# EAGLE design PiZero-RAK (EAGLE 9.0.1)
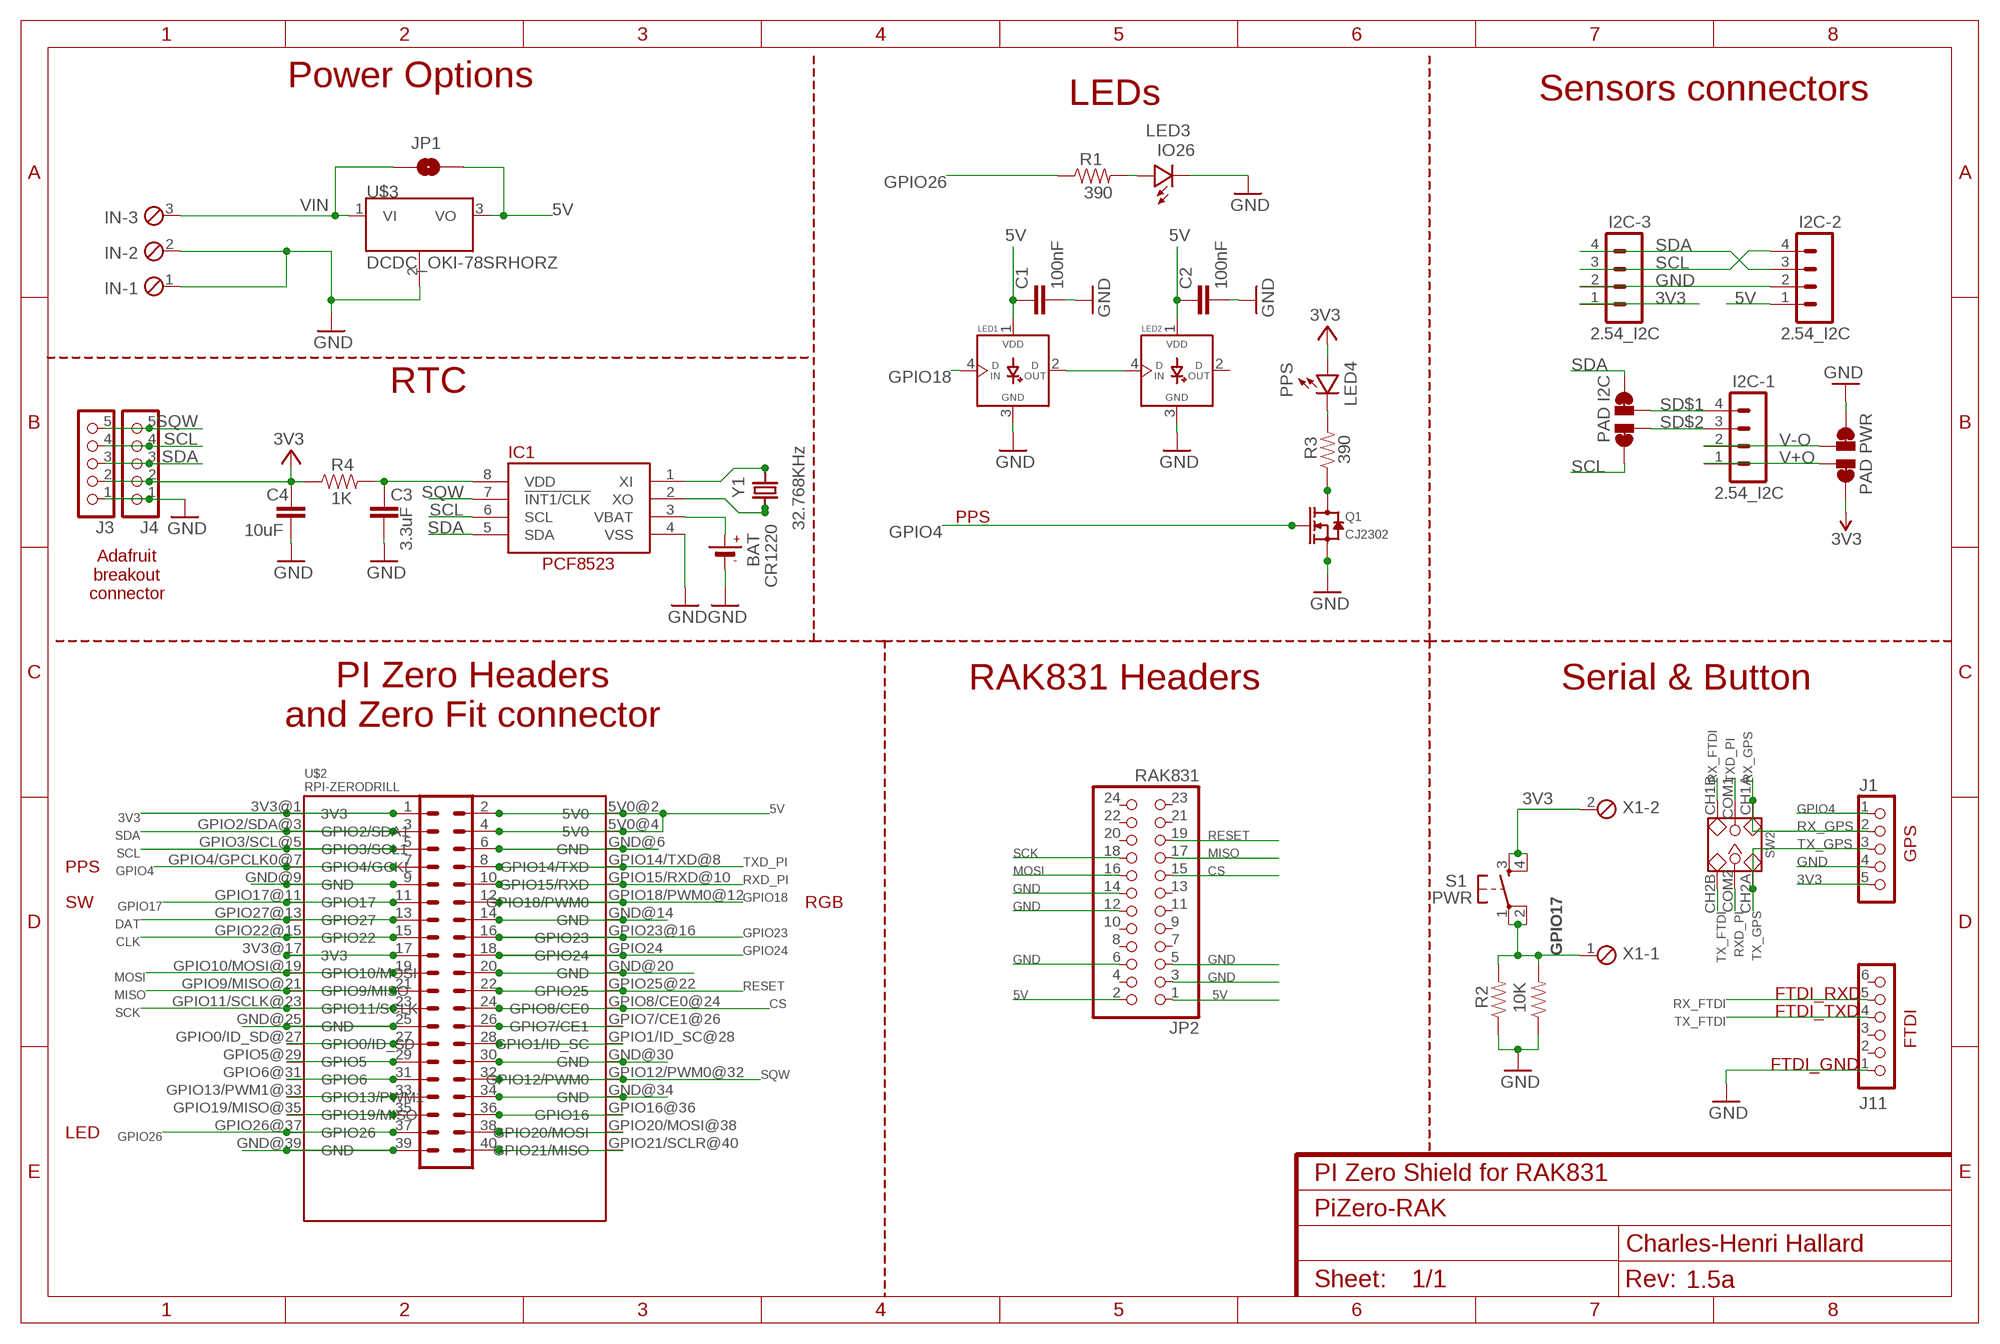
[diagram p0: schematic, sheet 1]
NAME (FRAME-A4L): CNAME: PI Zero Shield for RAK831; CREVISION: 1.5a; DESIGNER: Charles-Henri Hallard

## Parts
BAT  CR1220  BATTERYCR1220_SMT  [CR1220]
C1  100nF  CAP0805-CAP-LARGEPADS  [0805-CAP-LARGEPADS]
C2  100nF  CAP0805-CAP-LARGEPADS  [0805-CAP-LARGEPADS]
C3  3.3uF  CAP0805-CAP-LARGEPADS  [0805-CAP-LARGEPADS]
C4  10uF  CAP0805-CAP-LARGEPADS  [0805-CAP-LARGEPADS]
I2C-1  2.54_I2C  CON_HEADER_1X04'NO_LOCK'  [1X04_NO_LOCK]
I2C-2  2.54_I2C  CON_HEADER_1X04'NO_LOCK'  [1X04_NO_LOCK]
I2C-3  2.54_I2C  CON_HEADER_1X04'NO_LOCK'  [1X04_NO_LOCK]
IC1  PCF8523  RTC_PCF8523T  [SOIC8_150MIL]
IN  MPT3  [3POL254]
J1  CON_HEADER_1X05-PTH  [M1X5]
J2  CONN_20X2HLE  [2X20-HLE]
J3  CON_HEADER_1X05-PTH  [M1X5]
J4  CON_HEADER_1X05-PTH  [M1X5]
J11  CON_HEADER_1X06-PTH  [M1X6]
JP1  JUMPER-PAD-2-NOYES_SILK  [PAD-JUMPER-2-NO_YES_SILK]
JP2  RAK831  PINHD-2X12  [2X12]
LED1  WS2812BLONG  [WS2812B-LONG]
LED2  WS2812BLONG  [WS2812B-LONG]
LED3  IO26  LED0805-LARGE  [0805-LED-LARGEPADS]
LED4  PPS  LED0805-LARGE  [0805-LED-LARGEPADS]
Q1  CJ2302  SMD-MOSFET-N-CH-20V-2.1A-CJ2302(SOT-23)  [SOT-23]
R1  390  RESISTOR0805-RES  [0805-RES]
R2  10K  RESISTORAXIAL-0.3  [AXIAL-0.3]
R3  390  RESISTOR0805-RES  [0805-RES]
R4  1K  RESISTOR0805-RES  [0805-RES]
R105  RESISTOR0805-RES  [0805-RES]
S1  PWR  TACTILE-SWITCH-PTH  [TAC-SWITCH-PTH]
SW2  DIP-TOGGLE-SWITCH-2CH-(2X3P-2.54)  [SW6-2.54-9.0X3.5X3.2+2.0MM]
U$2  RPI-ZERODRILL  [RPI-ZERO-DRILLS]
U$3  DCDC_OKI-78SRHORZ  [OKI-78SRH]
U$4  PAD PWR  PAD-JUMPER-SWAPSWAP  [PAD-JUMPER-SWAP]
U$5  PAD I2C  PAD-JUMPER-SWAPSWAP  [PAD-JUMPER-SWAP]
X1  MPT2  [2POL254]
Y1  32.768KHz  CRYSTALTC26H  [TC26H]
Y2  CRYSTAL8X3.8SMT  [CRYSTAL_8X3.8]

## Nets
3V3: C4.1 I2C-3.1 J1.5 J2.1 J3.2 J4.2 LED4.PLUS R4.1 S1.3 S1.4 U$2.3V3@1(3V3) U$4.4 U$4.44 X1.2
3V3@17: J2.17 U$2.3V3@17(3V3)
5V: C1.1 C2.1 I2C-2.1 J2.2 J2.4 JP1.2 JP2.1 JP2.2 LED1.1(VDD) LED2.1(VDD) U$2.5V0@2(5V0) U$2.5V0@4(5V0) U$3.3(VO)
CLK: J2.15 U$2.GPIO22@15(GPIO22)
CS: J2.24 JP2.15 U$2.GPIO8/CE0@24(GPIO8/CE0)
DAT: J2.13 U$2.GPIO27@13(GPIO27)
GND: BAT.- C1.2 C2.2 C3.2 C4.2 I2C-2.2 I2C-3.2 IC1.4(VSS) IN.1 IN.2 J1.4 J2.6 J2.9 J2.14 J2.20 J2.25 J2.30 J2.34 J2.39 J3.1 J4.1 J11.1 JP2.3 JP2.5 JP2.6 JP2.12 JP2.14 LED1.3(GND) LED2.3(GND) LED3.MINUS Q1.2(S) R2.P$1 R105.1 U$2.GND@6(GND) U$2.GND@9(GND) U$2.GND@14(GND) U$2.GND@20(GND) U$2.GND@25(GND) U$2.GND@30(GND) U$2.GND@34(GND) U$2.GND@39(GND) U$3.2(GND) U$4.1 U$4.11
GPIO4: J1.1 J2.7 Q1.1(G) U$2.GPIO4/GPCLK0@7(GPIO4/GCKL)
GPIO17: J2.11 R2.P$2 R105.2 S1.1 S1.2 U$2.GPIO17@11(GPIO17) X1.1
GPIO18: J2.12 LED1.4(DIN) U$2.GPIO18/PWM0@12(GPIO18/PWM0)
GPIO19: J2.35 U$2.GPIO19/MISO@35(GPIO19/MISO)
GPIO23: J2.16 U$2.GPIO23@16(GPIO23)
GPIO24: J2.18 U$2.GPIO24
GPIO26: J2.37 R1.1 U$2.GPIO26@37(GPIO26)
MISO: J2.21 JP2.17 U$2.GPIO9/MISO@21(GPIO9/MISO)
MOSI: J2.19 JP2.16 U$2.GPIO10/MOSI@19(GPIO10/MOSI)
N$14: J2.26 U$2.GPIO7/CE1@26(GPIO7/CE1)
N$16: LED3.PLUS R1.2
N$26: IC1.1(XI) Y1.1 Y2.P$4
N$27: Q1.3(D) R3.1
N$28: J2.28 U$2.GPIO1/ID_SC@28(GPIO1/ID_SC)
N$30: J2.36 U$2.GPIO16@36(GPIO16)
N$31: J2.38 U$2.GPIO20/MOSI@38(GPIO20/MOSI)
N$32: J2.40 U$2.GPIO21/SCLR@40(GPIO21/MISO)
N$33: J2.27 U$2.GPIO0/ID_SD@27(GPIO0/ID_SD)
N$34: J2.29 U$2.GPIO5@29(GPIO5)
N$35: J2.31 U$2.GPIO6@31(GPIO6)
N$36: J2.33 U$2.GPIO13/PWM1@33(GPIO13/PWM1)
N$37: LED4.MINUS R3.2
N$38: IC1.2(XO) Y1.2 Y2.P$1
N$39: LED1.2(DOUT) LED2.4(DIN)
RESET: J2.22 JP2.19 U$2.GPIO25@22(GPIO25)
RX_FTDI: J11.5 SW2.CH1B
RX_GPS: J1.2 SW2.CH1A
RXD_PI: J2.10 SW2.COM2 U$2.GPIO15/RXD@10(GPIO15/RXD)
SCK: J2.23 JP2.18 U$2.GPIO11/SCLK@23(GPIO11/SCLK)
SCL: I2C-2.4 I2C-3.3 IC1.6(SCL) J2.5 J3.4 J4.4 U$2.GPIO3/SCL@5(GPIO3/SCL1) U$5.1 U$5.11
SD$1: I2C-1.4 U$5.3
SD$2: I2C-1.3 U$5.2
SDA: I2C-2.3 I2C-3.4 IC1.5(SDA) J2.3 J3.3 J4.3 U$2.GPIO2/SDA@3(GPIO2/SDA1) U$5.4 U$5.44
SQW: IC1.7(!INT1/CLK) J2.32 J3.5 J4.5 U$2.GPIO12/PWM0@32(GPIO12/PWM0)
TX_FTDI: J11.4 SW2.CH2B
TX_GPS: J1.3 SW2.CH2A
TXD_PI: J2.8 SW2.COM1 U$2.GPIO14/TXD@8(GPIO14/TXD)
V+O: I2C-1.1 U$4.3
V-O: I2C-1.2 U$4.2
VBAT: BAT.+$1(+) IC1.3(VBAT)
VDD: C3.1 IC1.8(VDD) R4.2
VIN: IN.3 JP1.1 U$3.1(VI)
Unconnected: J11.2 J11.3 J11.6 JP2.4 JP2.7 JP2.8 JP2.9 JP2.10 JP2.11 JP2.13 JP2.20 JP2.21 JP2.22 JP2.23 JP2.24 LED2.2(DOUT)

## Notes on the sheet
- Power Options
- LEDs | Sensors connectors
- RTC
- PPS
- Adafruit
  breakout
  connector
- Serial & Button
- RAK831 Headers
- PI Zero Headers
  and Zero Fit connector
- GPS
- PPS
- SW | RGB
- FTDI_RXD
- FTDI_TXD
- FTDI
- FTDI_GND
- LED

## Library data of the parts
BAT = microbuilder:BATTERY: CR1220 SMT - Digikey: 3001K-ND CD2032 BAT-HLD-001 - Digikey: BAT-HLD-001-ND
C1-C4 = _c2h:CAP: Capacitor Standard 0603 ceramic capacitor, and 0.1" leaded capacitor.
I2C-1-I2C-3 = _c2h:CON_HEADER_1X04
IC1 = microbuilder:RTC_PCF8523
IN = con-phoenix-254:MPT3: PHOENIX CONNECTOR; OC_FARNELL: unknown; OC_NEWARK: unknown
J1 J3 J4 = dp_devices:CON_HEADER_1X05
J2 = _c2h:CONN_20X2: Multi connection point. Often used as Generic Header-pin footprint for 0.1 inch spaced/style header connections On any of the 0.1 inch spaced packages, you can populate with these: Break Away Headers - Straight <https://www.sparkfun.com/products/116> (PRT-00116) Break Away Male Headers - Right Angle <https://www.sparkfun.com/products/553> (PRT-00553) Female Headers <https://www.sparkfun.com/products/115> (PRT-00115) Break Away Headers - Machine Pin <https://www.sparkfun.com/products/117> (PRT-00117) Break Away Female Headers - Swiss Machine Pin <https://www.sparkfun.com/products/743> (PRT-00743)
J11 = _c2h:CON_HEADER_1X06
JP1 = SparkFun-Passives:JUMPER-PAD-2-NO
JP2 = pinhead:PINHD-2X12: PIN HEADER
LED1 LED2 = _c2h:WS2812B
LED3 LED4 = _c2h:LED
Q1 = Seeed-Transistor:SMD-MOSFET-N-CH-20V-2.1A-CJ2302(SOT-23): 305030015; MPN: CJ2302
R1-R4 R105 = _c2h:RESISTOR: Resistor Basic schematic elements and footprints for 0603, 1206, and PTH resistors.
S1 = GeekAmmo:TACTILE-SWITCH: Tactile Switch 4 Pins, SPST NO
SW2 = Seeed-Switch:DIP-TOGGLE-SWITCH-2CH-(2X3P-2.54): 311010004; MPN: MS-22D18 G2 ROHS
U$2 = tobias:RPI-ZERO
U$3 = _c2h:DCDC_OKI-78SR: 4.95W DC/DC Converter Manufacturer: Murata Part Number: OKI-78SR-5/1.5-W36H-C OKI-78SR-3.3/1.5-W36H-C
U$4 U$5 = _c2h:PAD-JUMPER-SWAP
X1 = con-phoenix-254:MPT2: PHOENIX CONNECTOR; OC_FARNELL: unknown; OC_NEWARK: unknown
Y1 = adafruit:CRYSTAL: CRYSTAL; OC_FARNELL: unknown; OC_NEWARK: unknown
Y2 = microbuilder:CRYSTAL: Crystals HC49UP - Surface Mount Crystal 4.0MHz 18pF +/-30ppm Surface Mount Crystal [Digikey: 535-9857-1-ND] 12.0 MHz Surface Mount Crystal [Digikey: 535-9869-6-ND] 25.0 MHz Surface Mount Crystal [Digikey: 535-9078-1-ND] 2.5 x 2.0mm - MEMs SMT Crystal 16.0 MHz 10pF 20ppm 2.5 x 2.0mm Crystal [Digikey -40-85°C: 535-10923-1-ND] 3.2 x 2.5mm - MEMs SMT Crystal 12.0 MHz 8pF 15ppm 3.2 x 2.5mm Crystal [Digikey: -10-70°C: 644-1047-1-ND -40-125°C: 644-1128-1-ND] 16.0 MHz 8pF 15ppm 3.2 x 2.5mm Crystal [Digikey: -10-70°C: 644-1049-1-ND -40-125°C: 644-1129-2-ND] 16.0 MHz 10pF 10ppm 3.2 x 2.5mm Crystal [Digikey: 644-1100-1-ND] 27.12 MHz 18pF 30ppm 3.2 x 2.5mm Crystal [Digikey: 887-1424-1-ND] 27.12MHz 10pF 10ppm 3.2 x 2.5mm Crystal [Digikey: 887-1329-1-ND] 4.9 x 1.8mm - MEMs SMT Crystal 32.768 KHz 12.5pF 20ppm 4.9 x 1.8mm Crystal [Digikey: SE2415CT-ND] 8.0 x 3.8mm - Surface Mount Crystal 32.768kHz 12.5pF 20ppm -40°C-85°C [Digikey: 535-9166-2-ND] Cylinder 32.768KHz Cylinder Crystal (2x6mm body) [Ex. Digikey: 300-8341-2-ND]

## Board
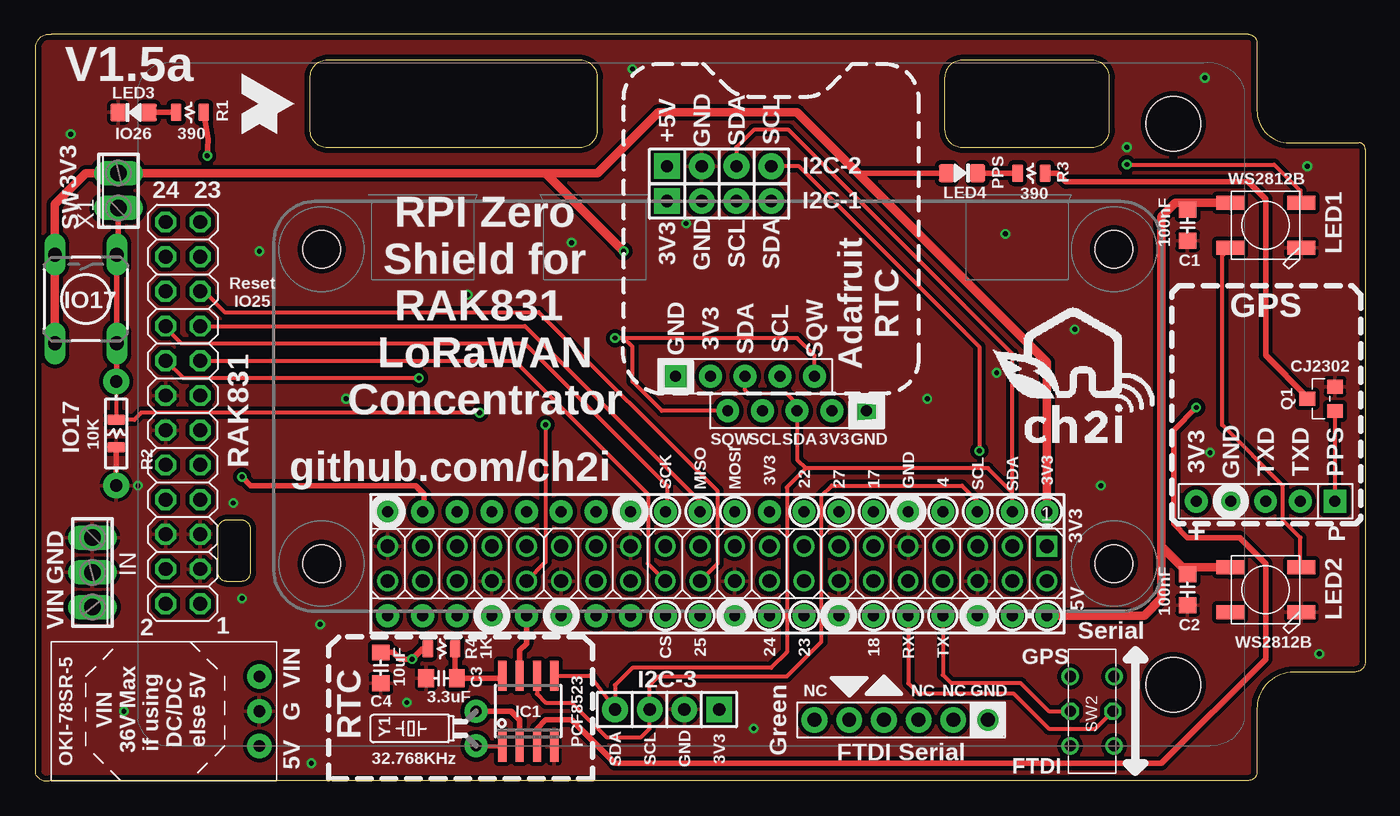
[diagram p1: board, top side]
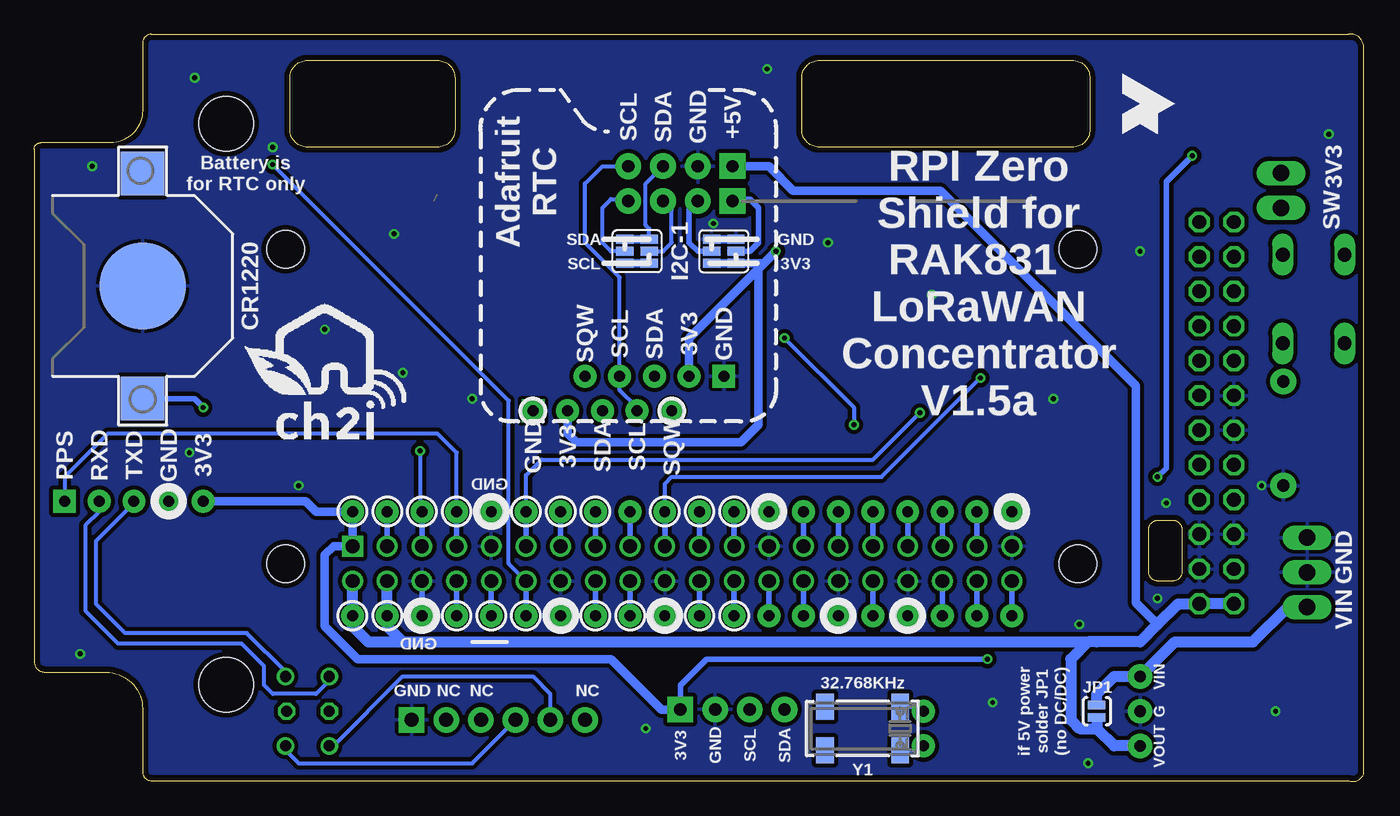
[diagram p2: board, bottom side, seen from below]

Size 97.31 x 54.68 mm. Coordinates in mm from the lower left corner, seen from the top.
Outline: 39.85,52.77 21.3,52.77 arc90 20.03,51.5 20.03,47.69 arc90 21.3,46.42 39.85,46.42 arc90 41.12,47.69 41.12,51.5 arc90 39.85,52.77
Outline: 77.31,52.77 67.79,52.77 arc90 66.52,51.5 66.52,47.69 arc90 67.79,46.42 77.31,46.42 arc90 78.58,47.69 78.58,51.5 arc90 77.31,52.77
Outline: 15.08,19.11 13.94,19.11 arc90 13.3,18.48 13.3,15.3 arc90 13.94,14.67 15.08,14.67 arc90 15.72,15.3 15.72,18.48 arc90 15.08,19.11
Outline: 88.74,54.67 arc-90 89.38,54.04 89.38,49.12 arc90 91.76,46.73 96.84,46.73 arc-90 97.31,46.26 97.31,8.79 arc-90 96.52,8 92.08,8 arc90 89.38,5.3 89.38,0.7 arc-90 88.74,0.06 1.11,0.06 arc-90 0,0.54 0,53.88 arc-90 1.11,54.67 88.74,54.67
Copper layers (1*16): Top 0.0356mm / dielectric 1.5011mm / Bottom 0.0356mm
Design rules "PCBs_io": minimum track width 6mil, minimum drill 13mil, track to track 6mil, track to pad 6mil, pad to pad 6mil, via to via 6mil, smd to smd 6mil, copper to edge 15mil, drill to drill 6mil, minimum pad ring 7mil, minimum via ring 7mil, stop-mask expansion 3mil, vias tented up to drill 40mil, thermal gap 10mil
Holes 4 mm at 83.26,7.08 83.26,48.13

### Footprints (pad centres in the part's own frame; a part is rotated, then mirrored left to right if it is on the bottom)
CR1220 = smd 3.2 x 3.2: +$1 -8.225,0; +$2 8.225,0 | smd 6.35 x 6.35: - 0,0
0805-CAP-LARGEPADS = smd 1.156 x 1.3: 1 -1.127,0; 2 1.127,0
1X04_NO_LOCK = drill 0.9 pad 1.88 square: 1 -3.816,-0.121 | drill 0.9 pad 1.88: 2 -1.27,-0.133; 3 1.27,-0.121; 4 3.81,-0.133
SOIC8_150MIL = smd 0.6 x 2.2: 1 -1.905,-2.6; 2 -0.635,-2.6; 3 0.635,-2.6; 4 1.905,-2.6; 5 1.905,2.6; 6 0.635,2.6; 7 -0.635,2.6; 8 -1.905,2.6
3POL254 = drill 1.2 long: 1 -2.54,0; 2 0,0; 3 2.54,0
M1X5 = drill 0.8 pad 1.676 square: 1 -5.08,0 | drill 0.8 pad 1.676: 2 -2.54,0; 3 0,0; 4 2.54,0; 5 5.08,0
2X20-HLE = drill 0.8 pad 1.676: 1 -24.13,-3.81; 2 -24.13,3.81; 3 -21.59,-3.81; 4 -21.59,3.81; 5 -19.05,-3.81; 6 -19.05,3.81; 7 -16.51,-3.81; 8 -16.51,3.81; 9 -13.97,-3.81; 10 -13.97,3.81; 11 -11.43,-3.81; 12 -11.43,3.81; 13 -8.89,-3.81; 14 -8.89,3.81; 15 -6.35,-3.81; 16 -6.35,3.81; 17 -3.81,-3.81; 18 -3.81,3.81; 19 -1.27,-3.81; 20 -1.27,3.81; 21 1.27,-3.81; 22 1.27,3.81; 23 3.81,-3.81; 24 3.81,3.81; 25 6.35,-3.81; 26 6.35,3.81; 27 8.89,-3.81; 28 8.89,3.81; 29 11.43,-3.81; 30 11.43,3.81; 31 13.97,-3.81; 32 13.97,3.81; 33 16.51,-3.81; 34 16.51,3.81; 35 19.05,-3.81; 36 19.05,3.81; 37 21.59,-3.81; 38 21.59,3.81; 39 24.13,-3.81; 40 24.13,3.81
M1X6 = drill 1.02 pad 1.88 square: 1 0,0 | drill 1.02 pad 1.88: 2 2.54,0; 3 5.08,0; 4 7.62,0; 5 10.16,0; 6 12.7,0
PAD-JUMPER-2-NO_YES_SILK = smd 0.635 x 1.27: 1 -0.45,0; 2 0.45,0
2X12 = drill 1.016 octagon: 1 -13.97,-1.27; 2 -13.97,1.27; 3 -11.43,-1.27; 4 -11.43,1.27; 5 -8.89,-1.27; 6 -8.89,1.27; 7 -6.35,-1.27; 8 -6.35,1.27; 9 -3.81,-1.27; 10 -3.81,1.27; 11 -1.27,-1.27; 12 -1.27,1.27; 13 1.27,-1.27; 14 1.27,1.27; 15 3.81,-1.27; 16 3.81,1.27; 17 6.35,-1.27; 18 6.35,1.27; 19 8.89,-1.27; 20 8.89,1.27; 21 11.43,-1.27; 22 11.43,1.27; 23 13.97,-1.27; 24 13.97,1.27
WS2812B-LONG = smd 2.032 x 1.016: 1 2.609,-1.65; 2 2.609,1.65; 3 -2.609,1.65; 4 -2.609,-1.65
0805-LED-LARGEPADS = smd 1.156 x 1.3: MINUS -1.127,0; PLUS 1.127,0
SOT-23 = smd 1.016 x 1.143: 1 -0.889,-1.016; 2 0.889,-1.016; 3 0,1.016
0805-RES = smd 0.8 x 1.3: 1 -1,0; 2 1,0
AXIAL-0.3 = drill 0.9 pad 1.88: P$1 -3.81,0; P$2 3.81,0
TAC-SWITCH-PTH = drill 1.016 pad 1.524 long: 1 -3.251,2.261; 2 3.251,2.261; 3 -3.251,-2.261; 4 3.251,-2.261
SW6-2.54-9.0X3.5X3.2+2.0MM = drill 0.813 pad 1.27: CH1A -2.54,-1.6; CH1B 2.54,-1.6; CH2A -2.54,1.6; CH2B 2.54,1.6 | drill 0.813 pad 1.27 octagon: COM1 0,-1.6; COM2 0,1.524
RPI-ZERO-DRILLS = drill 1.016 square: 3V3@1 8.89,25.4 | drill 1.016: 3V3@17 29.21,25.4; 5V0@2 8.89,27.94; 5V0@4 11.43,27.94; GND@6 13.97,27.94; GND@9 19.05,25.4; GND@14 24.13,27.94; GND@20 31.75,27.94; GND@25 39.37,25.4; GND@30 44.45,27.94; GND@34 49.53,27.94; GND@39 57.15,25.4; GPIO0/ID_SD@27 41.91,25.4; GPIO1/ID_SC@28 41.91,27.94; GPIO2/SDA@3 11.43,25.4; GPIO3/SCL@5 13.97,25.4; GPIO4/GPCLK0@7 16.51,25.4; GPIO5@29 44.45,25.4; GPIO6@31 46.99,25.4; GPIO7/CE1@26 39.37,27.94; GPIO8/CE0@24 36.83,27.94; GPIO9/MISO@21 34.29,25.4; GPIO10/MOSI@19 31.75,25.4; GPIO11/SCLK@23 36.83,25.4; GPIO12/PWM0@32 46.99,27.94; GPIO13/PWM1@33 49.53,25.4; GPIO14/TXD@8 16.51,27.94; GPIO15/RXD@10 19.05,27.94; GPIO16@36 52.07,27.94; GPIO17@11 21.59,25.4; GPIO18/PWM0@12 21.59,27.94; GPIO19/MISO@35 52.07,25.4; GPIO20/MOSI@38 54.61,27.94; GPIO21/SCLR@40 57.15,27.94; GPIO22@15 26.67,25.4; GPIO23@16 26.67,27.94; GPIO24 29.21,27.94; GPIO25@22 34.29,27.94; GPIO26@37 54.61,25.4; GPIO27@13 24.13,25.4 | hole 2.75: 3.99,3.66; 3.99,26.66; 61.99,3.66; 61.99,26.66
OKI-78SRH = drill 0.864 pad 1.778: 1 2.54,0; 2 0,0; 3 -2.54,0
PAD-JUMPER-SWAP = smd 0.635 x 1.27: 1 -0.876,0.889; 2 0,-0.889; 3 0,0.889; 4 0.876,-0.889; 11 -0.876,-0.889; 44 0.876,0.889
2POL254 = drill 1.2 long: 1 -1.27,0; 2 1.27,0
TC26H = drill 0.813 pad 1.676: 1 -1.27,0; 2 1.27,0
CRYSTAL_8X3.8 = smd 1.3 x 1.9: P$1 -2.75,-1.6; P$2 2.75,-1.6; P$3 2.75,1.6; P$4 -2.75,1.6

### Placement (x,y rotation side)
BAT  89.38,36.26 90 bottom
C1  84.3,40.7 270 top
C2  84.3,14.03 270 top
C3  29.69,7.55 180 top
C4  25.24,8.32 270 top
I2C-1  50.01,42.61 0 top
I2C-2  50.01,45.15 0 top
I2C-3  46.2,5.14 180 top
IC1  36.04,5.14 0 top
IN  4.13,15.3 270 top
J1  90.01,20.51 180 top
J2  49.88,15.94 180 top
J3  51.91,29.65 0 top
J4  55.72,27.11 180 top
J11  69.69,4.51 180 top
JP1  19.53,5.14 270 bottom
JP2  10.76,26.97 90 top
LED1  90.01,40.7 180 top
LED2  90.01,14.03 180 top
LED3  7.14,48.96 0 top
LED4  67.79,44.51 180 top
Q1  94.08,28 90 top
R1  11.27,48.96 180 top
R2  5.87,25.46 90 top
R3  72.87,44.51 180 top
R4  29.69,9.71 0 top
R105  5.87,25.46 90 top
S1  3.65,35.3 270 top
SW2  77.31,5.14 270 top
U$1  [LOGO_CH2I_110MM]  76.55,27.75 0 top
U$2  82.9,42.61 180 top
U$3  16.35,5.14 90 top
U$4  46.83,38.8 270 bottom
U$5  53.18,38.8 90 bottom
U$6  [RICAUN]  16.35,49.59 0 top
U$7  [RICAUN]  16.35,49.59 0 bottom
U$9  [LOGO_CH2I_110MM]  75.41,28 0 bottom
X1  6.03,43.24 90 top
Y1  32.23,3.87 90 top
Y2  36.67,3.87 180 bottom

### Tracks (layer width: path | path; a pad name or v marks a point on that pad's centre or on a via)
3V3  (via drill 0.36 pad 0.71)
  Top 0.406: 61.07,43.61 61.44,43.24 | 25.38,9.59 C4.1 25.26,9.46 26.13,9.46 26.64,8.95 v27.53,8.95 28.29,9.71 R4.1 | LED4.PLUS 60.17,44.51
  Top 0.61: 37.31,44.51 41.12,44.51 45.56,48.96 55.72,48.96 60.17,44.51 61.44,43.24 74.01,30.67 J2.1 | S1.4 S1.3 1.39,42.25 3.65,44.51 X1.2 37.31,44.51 | v43.02,38.8 37.31,44.51
  Bottom 0.305: U$4.44 U$4.4
  Bottom 0.406: I2C-3.1 50.01,5.9 50.01,7.05 48.1,8.95 v27.53,8.95
  Bottom 0.61: U$4.44 43.9,37.92 | 43.9,37.92 v43.02,38.8 | I2C-3.1 51.4,5.26 55.09,8.95 73.63,8.95 76.04,11.36 76.04,16.57 75.41,17.21 U$2.3V3@1 J2.1 76.68,19.75 77.44,20.51 J1.5 | J3.2 49.37,32.45 44.29,37.53 | 44.29,37.53 44.29,26.1 45.56,24.83 57.63,24.83 58.26,25.46 J4.2 | 44.29,37.53 43.9,37.92
3V3@17
  Bottom 0.406: U$2.3V3@17 J2.17
5V
  Top 0.406: 87.47,41.97 87.47,42.28 LED1.1 87.47,42.42 | 87.47,15.3 87.47,15.61 LED2.1
  Top 0.61: 82.39,17.21 82.39,41.34 83.41,42.35 84.3,42.35 | 82.39,17.21 82.39,13.4 81.12,12.13 J2.2 | LED2.1 84.3,15.68 | 84.3,15.68 83.92,15.68 82.39,17.21 | C2.1 84.3,15.68 | LED1.1 84.3,42.35 | C1.1 84.3,42.35
  Bottom 0.61: JP1.2 19.53,4.51 | I2C-2.1 43.54,45.03 41.75,43.24 30.96,43.24 16.67,28.95 16.67,13.08 15.08,11.49
  Bottom 0.813: 70.33,10.22 71.47,11.36 J2.4 U$2.5V0@4 | U$2.5V0@2 J2.2 74.01,11.36 72.87,10.22 70.33,10.22 | JP2.2 JP2.1 13.57,13 15.08,11.49 16.35,10.22 19.53,10.22 20.16,10.22 | U$3.3 18.26,2.6 19.53,3.87 | 19.53,4.51 19.53,3.87 | 20.16,10.22 21.43,8.95 21.43,4.51 20.8,3.87 19.53,3.87 | 70.33,10.22 20.16,10.22
CLK
  Bottom 0.406: U$2.GPIO22@15 J2.15
CS
  Top 0.305: JP2.15 35.03,30.78 44.8,21.02 44.8,15.94 U$2.GPIO8/CE0@24
  Bottom 0.406: J2.24 U$2.GPIO8/CE0@24
DAT
  Bottom 0.406: U$2.GPIO27@13 J2.13
GND  (via drill 0.36 pad 0.71)
  Top 0.406: R105.1 R2.P$1
  Bottom 0.305: U$4.11 U$4.1
  Bottom 0.406: U$2.GND@6 J2.6
  other vias: 43.66,52.13 31.59,35.62 79.85,46.42 85.57,51.5 93.95,9.33 20.16,1.33 20.8,11.49 22.7,28 65.25,28 70.33,29.91 39.21,39.43 77.95,21.65 70.96,40.07 16.35,38.8 2.54,47.37 93.06,45.02 6.45,5.14 7.46,21.65 76.04,33.08 47.59,40.83 15.08,13.4 14.45,20.38 85.95,24.06 27.15,5.78 52.55,3.87
  pour Bottom (isolate 0.305): -9.68,-1.21 98.27,-1.21 98.27,55.94 -9.68,55.94
  pour Top (isolate 0.305): -9.05,55.31 97.63,55.31 97.63,-0.57 -9.05,-0.57
GPIO4
  Top 0.305: Q1.1 J1.1
  Bottom 0.305: J2.7 66.39,24.06 67.79,25.46 91.92,25.46 95.09,22.29 J1.1
  Bottom 0.406: U$2.GPIO4/GPCLK0@7 J2.7
GPIO17  (via drill 0.36 pad 0.71)
  Top 0.305: R2.P$2 R105.2 | 6.3,26.46 R105.2 | R105.2 7.19,26.46 7.72,26.99 v32.48,26.99
  Top 0.406: X1.1 6.03,38.68 S1.1 S1.2 5.91,29.31 R2.P$2
  Bottom 0.305: J2.11 61.31,22.41 60.17,23.56 35.91,23.56 v32.48,26.99
  Bottom 0.406: U$2.GPIO17@11 J2.11
GPIO18  (via drill 0.36 pad 0.71)
  Top 0.305: v79.85,45.15 90.65,45.15 92.55,43.24 92.55,42.42 LED1.4
  Top 0.406: 92.37,42.61 LED1.4
  Bottom 0.305: U$2.GPIO18/PWM0@12 62.58,15.94 62.58,27.87 v79.85,45.15
  Bottom 0.406: U$2.GPIO18/PWM0@12 J2.12
GPIO19
  Bottom 0.406: J2.35 U$2.GPIO19/MISO@35
GPIO23
  Bottom 0.406: U$2.GPIO23@16 J2.16
GPIO24
  Bottom 0.406: U$2.GPIO24 J2.18
GPIO26  (via drill 0.36 pad 0.71)
  Top 0.406: v15.08,22.29 15.72,21.65 27.78,21.65 28.42,21.02 28.42,19.87 J2.37 | R1.1 12.59,47 v12.54,45.78
  Bottom 0.406: J2.37 U$2.GPIO26@37 | v15.08,22.29 14.45,22.92 14.45,43.88 v12.54,45.78
MISO
  Top 0.305: J2.21 48.61,20.51 35.8,33.32 JP2.17
  Bottom 0.406: U$2.GPIO9/MISO@21 J2.21
MOSI  (via drill 0.36 pad 0.71)
  Top 0.305: JP2.16 9.51,30.78 10.76,29.53 v28.04,29.53
  Bottom 0.305: J2.19 51.15,21.78 50.64,22.29 35.27,22.29 v28.04,29.53
  Bottom 0.406: U$2.GPIO10/MOSI@19 J2.19
N$14
  Bottom 0.406: J2.26 U$2.GPIO7/CE1@26
N$16
  Top 0.406: R1.2 LED3.PLUS
N$26
  Top 0.305: IC1.1 32.29,2.54 Y1.1
  Bottom 0.305: Y2.P$4 32.56,2.27 Y1.1
N$27
  Top 0.406: Q1.3 93.06,28.13 90.01,31.18 90.01,42.61 88.74,43.88 75.41,43.88 74.77,44.51 R3.1
N$28
  Bottom 0.406: J2.28 U$2.GPIO1/ID_SC@28
N$30
  Bottom 0.406: J2.36 U$2.GPIO16@36
N$31
  Bottom 0.406: J2.38 U$2.GPIO20/MOSI@38
N$32
  Bottom 0.406: J2.40 U$2.GPIO21/SCLR@40
N$33
  Bottom 0.406: U$2.GPIO0/ID_SD@27 J2.27
N$34
  Bottom 0.406: U$2.GPIO5@29 J2.29
N$35
  Bottom 0.406: U$2.GPIO6@31 J2.31
N$36
  Bottom 0.406: U$2.GPIO13/PWM1@33 J2.33
N$37
  Top 0.406: R3.2 LED4.MINUS
N$38
  Top 0.406: Y1.2 34.77,5.14 35.4,4.51 IC1.2
  Bottom 0.305: Y2.P$1 32.56,5.47 Y1.2
N$39
  Top 0.305: 92.55,15.75 92.55,17.84 91.28,19.11 91.28,21.65 86.84,26.1 86.84,38.49 LED1.2
  Top 0.406: 87.66,38.8 LED1.2 | 92.37,15.94 92.55,15.75 LED2.4
RESET
  Top 0.305: JP2.19 12.3,35.86 13.81,34.35 36.8,34.35 49.88,21.27 49.88,15.94 U$2.GPIO25@22
  Bottom 0.406: J2.22 U$2.GPIO25@22
RX_FTDI
  Bottom 0.305: SW2.CH1B 75.41,2.6 70.33,7.68 60.8,7.68 59.53,6.41 J11.5
RX_GPS
  Bottom 0.305: J1.2 92.55,19.75 93.57,18.73 93.57,12.51 91.15,10.09 82.14,10.09 80.49,8.44 80.49,7.05 79.85,6.41 76.68,6.41 75.71,7.38 SW2.CH1A
RXD_PI
  Top 0.305: J2.10 63.85,7.17 64.61,6.41 71.6,6.41 74.14,3.87 77.57,3.87 SW2.COM2
  Bottom 0.406: U$2.GPIO15/RXD@10 J2.10
SCK
  Top 0.305: JP2.18 9.49,33.22 10.64,32.07 35.78,32.07 46.2,21.65 46.2,19.87 J2.23
  Bottom 0.406: U$2.GPIO11/SCLK@23 J2.23
SCL  (via drill 0.36 pad 0.71)
  Top 0.305: I2C-3.3 44.93,7.05 45.56,7.68 54.96,7.68 57.5,10.22 57.5,20.89 58.26,21.65 67.79,21.65 68.93,20.51 J2.5 | U$2.GPIO3/SCL@5 68.93,17.33 | v69.06,24.19 69.06,31.81 55.85,45.01 I2C-2.4 | 44.93,4.51 I2C-3.3 | IC1.6 36.67,6.41 37.31,5.78 39.21,5.78 41.75,3.24 44.29,3.24 44.93,3.87 I2C-3.3
  Bottom 0.305: v69.06,24.19 69.06,19.87 J2.5 | 55.48,37.92 U$5.1 U$5.11 | 55.48,37.92 56.99,39.43 56.99,43.74 55.72,45.01 I2C-2.4 | 55.48,37.92 54.45,36.89 J3.4 54.45,28.64 53.18,27.37 J4.4
  Bottom 0.406: J2.5 U$2.GPIO3/SCL@5
SD$1
  Bottom 0.305: U$5.3 55.09,38.8 55.72,39.43 55.72,41.97 55.09,42.61 53.95,42.61 I2C-1.4
SD$2
  Bottom 0.305: U$5.2 51.28,38.8 50.64,39.43 50.64,41.85 I2C-1.3
SDA
  Top 0.305: U$2.GPIO2/SDA@3 71.47,17.33 | 56.36,22.92 69.69,22.92 71.47,21.14 | 56.36,22.92 54.96,21.52 54.96,9.46 53.82,8.32 43.66,8.32 42.39,7.05 I2C-3.4 40.55,7.74 IC1.5 | J2.3 71.47,21.14 | 71.47,21.14 71.47,31.3 55.09,47.69 52.55,47.69 51.28,46.42 I2C-2.3 | 56.36,22.92 55.72,23.56 J4.3 55.72,27.62 54.96,28.38 52.17,28.38 51.91,28.64 J3.3
  Bottom 0.305: I2C-2.3 52.55,43.76 52.55,40.7 52.29,40.45 U$5.4 U$5.44
  Bottom 0.406: J2.3 U$2.GPIO2/SDA@3
SQW  (via drill 0.36 pad 0.71)
  Top 0.305: J3.5 56.99,31.18 55.72,32.45 43.02,32.45 | 43.02,32.45 v42.39,32.45 | v37.31,26.1 37.31,16.06 U$2.GPIO12/PWM0@32 | J4.5 45.82,27.11 43.66,29.27 43.66,31.81 43.02,32.45
  Top 0.406: J2.32 35.91,10.09 35.4,9.59 IC1.7
  Bottom 0.305: v42.39,32.45 37.31,27.37 v37.31,26.1
  Bottom 0.406: J2.32 U$2.GPIO12/PWM0@32
TX_FTDI
  Bottom 0.305: SW2.CH2B 78.91,2.3 77.95,1.33 65.25,1.33 J11.4
TX_GPS
  Bottom 0.305: J1.3 89.88,20.51 92.81,17.59 92.81,13.02 90.65,10.86 81.76,10.86 78.91,8.01 SW2.CH2A
TXD_PI
  Top 0.305: J2.8 66.39,7.81 67.02,7.17 72.1,7.17 74.14,5.14 SW2.COM1
  Bottom 0.406: U$2.GPIO14/TXD@8 J2.8
V+O
  Bottom 0.406: U$4.3 44.93,38.8 44.29,39.43 44.29,41.97 44.93,42.61 46.07,42.61 I2C-1.1
V-O
  Bottom 0.406: U$4.2 48.74,38.8 49.37,39.43 49.37,41.84 I2C-1.2
VBAT  (via drill 0.36 pad 0.71)
  Top 0.406: IC1.3 36.67,3.87 37.31,4.51 39.21,4.51 42.39,1.33 82.39,1.33 90.01,8.95 90.01,15.94 88.11,17.84 84.3,17.84 83.28,18.86 83.28,25.72 v84.93,27.37
  Bottom 0.406: v84.93,27.37 85.57,28 89.35,28 BAT.+$1
VDD
  Top 0.406: 34.07,7.74 IC1.8 34.07,7.55 C3.1 30.69,7.81 R4.2
VIN
  Bottom 0.61: 19.53,5.78 JP1.1
  Bottom 0.813: 19.53,5.78 19.53,6.41 18.26,7.68 U$3.1 13.81,10.22 8.1,10.22 5.56,12.76 IN.3

### Text on the board
tPlace: V1.5a | +5V | GND | SDA | SCL | 3V3 | I2C-2 | 24 | 23 | WS2812B | I2C-1 | SW | 3V3 | GND | SCL | SDA | Reset / IO25 | RPI Zero / Shield for / RAK831 / LoRaWAN / Concentrator | Adafruit / RTC | GPS | GND | 3V3 | SDA | SCL | SQW | CJ2302 | SQW | SCL | SDA | 3V3 | GND | 3V3 | GND | TXD | TXD | PPS | github.com/ch2i | 3V3 | + | P | GND | 5V | VIN | 2 | 1 | Serial | WS2812B | VIN | GPS | I2C-3 | NC | NC | NC | GND | VIN / 36V Max / if using / DC/DC / else 5V | RTC | OKI-78SR-5 | G | Green | SDA | SCL | GND | 3V3 | 5V | FTDI Serial | FTDI
bPlace: +5V | GND | SDA | SCL | 3V3 | Battery is / for RTC only | Adafruit / RTC | SW | GND | SDA | I2C-1 | 3V3 | SCL | RPI Zero / Shield for / RAK831 / LoRaWAN / Concentrator / V1.5a | GND | 3V3 | SDA | SCL | SQW | SQW | SCL | SDA | 3V3 | GND | 3V3 | GND | TXD | RXD | PPS | GND | VIN | 32.768KHz | NC | NC | NC | GND | if 5V power / solder JP1 / (no DC/DC) | SDA | SCL | GND | 3V3 | Y1
tNames: LED1 | IO17 | IO17 | SCK | MISO | MOSI | 3V3 | GND | SCL | SDA | 3V3 | 22 | 27 | 17 | 4 | LED2 | CS | 25 | 24 | 23 | 18 | RX | TX
bNames: GND | GND